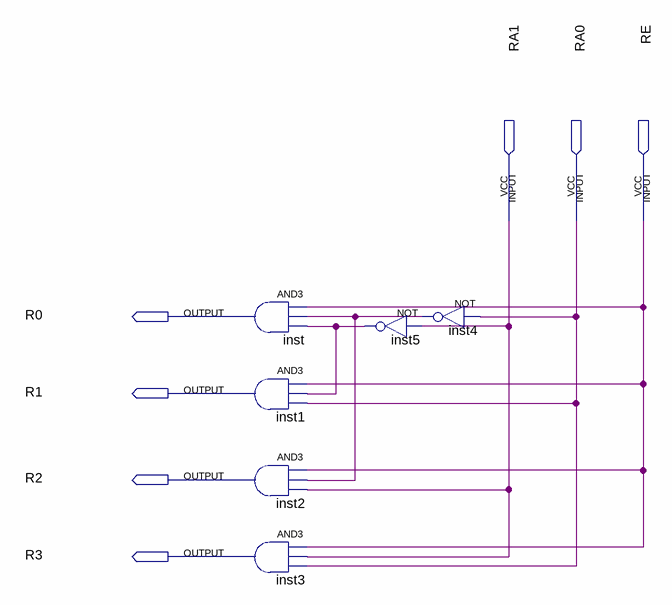
[diagram p0: schematic sheet]
// Quartus schematic 2to4RD.bdf as structural Verilog: 6 symbols, 7 pins
module \2to4RD  (
  input  RA1,
  input  RA0,
  input  RE,
  output R0,
  output R1,
  output R2,
  output R3
);

  wire inst4_out, inst5_out;

  and inst (R0, RE, inst4_out, inst5_out);
  and inst1 (R1, RE, inst5_out, RA0);
  and inst2 (R2, RE, inst4_out, RA1);
  and inst3 (R3, RE, RA1, RA0);
  not inst5 (inst5_out, RA1);
  not inst4 (inst4_out, RA0);
endmodule
